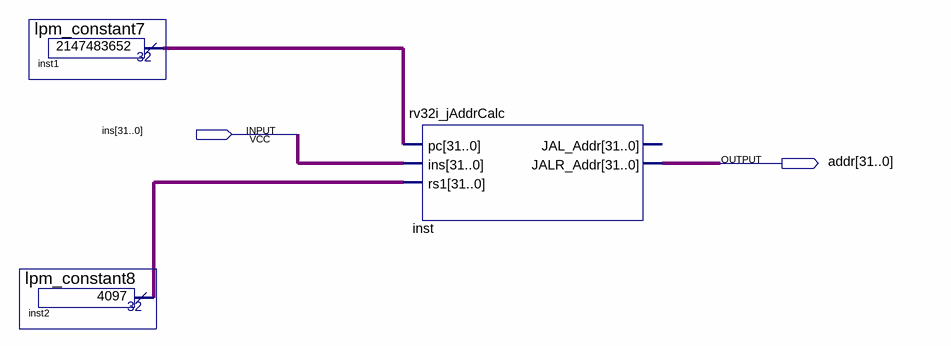
[diagram p0: schematic sheet]
// Quartus schematic rv32i_jAddrCalc_tester.bdf as structural Verilog: 3 symbols, 2 pins
module rv32i_jAddrCalc_tester (
  input  [31:0] ins,
  output [31:0] addr
);

  wire [31:0] inst1_result, inst2_result;

  lpm_constant7 inst1 (.result(inst1_result));
  lpm_constant8 inst2 (.result(inst2_result));
  rv32i_jAddrCalc inst (.pc(inst1_result), .ins(ins), .rs1(inst2_result), .JALR_Addr(addr));  // open: JAL_Addr
endmodule
